# Altium project 830-00007, M2 Focus Drive.PrjPCB
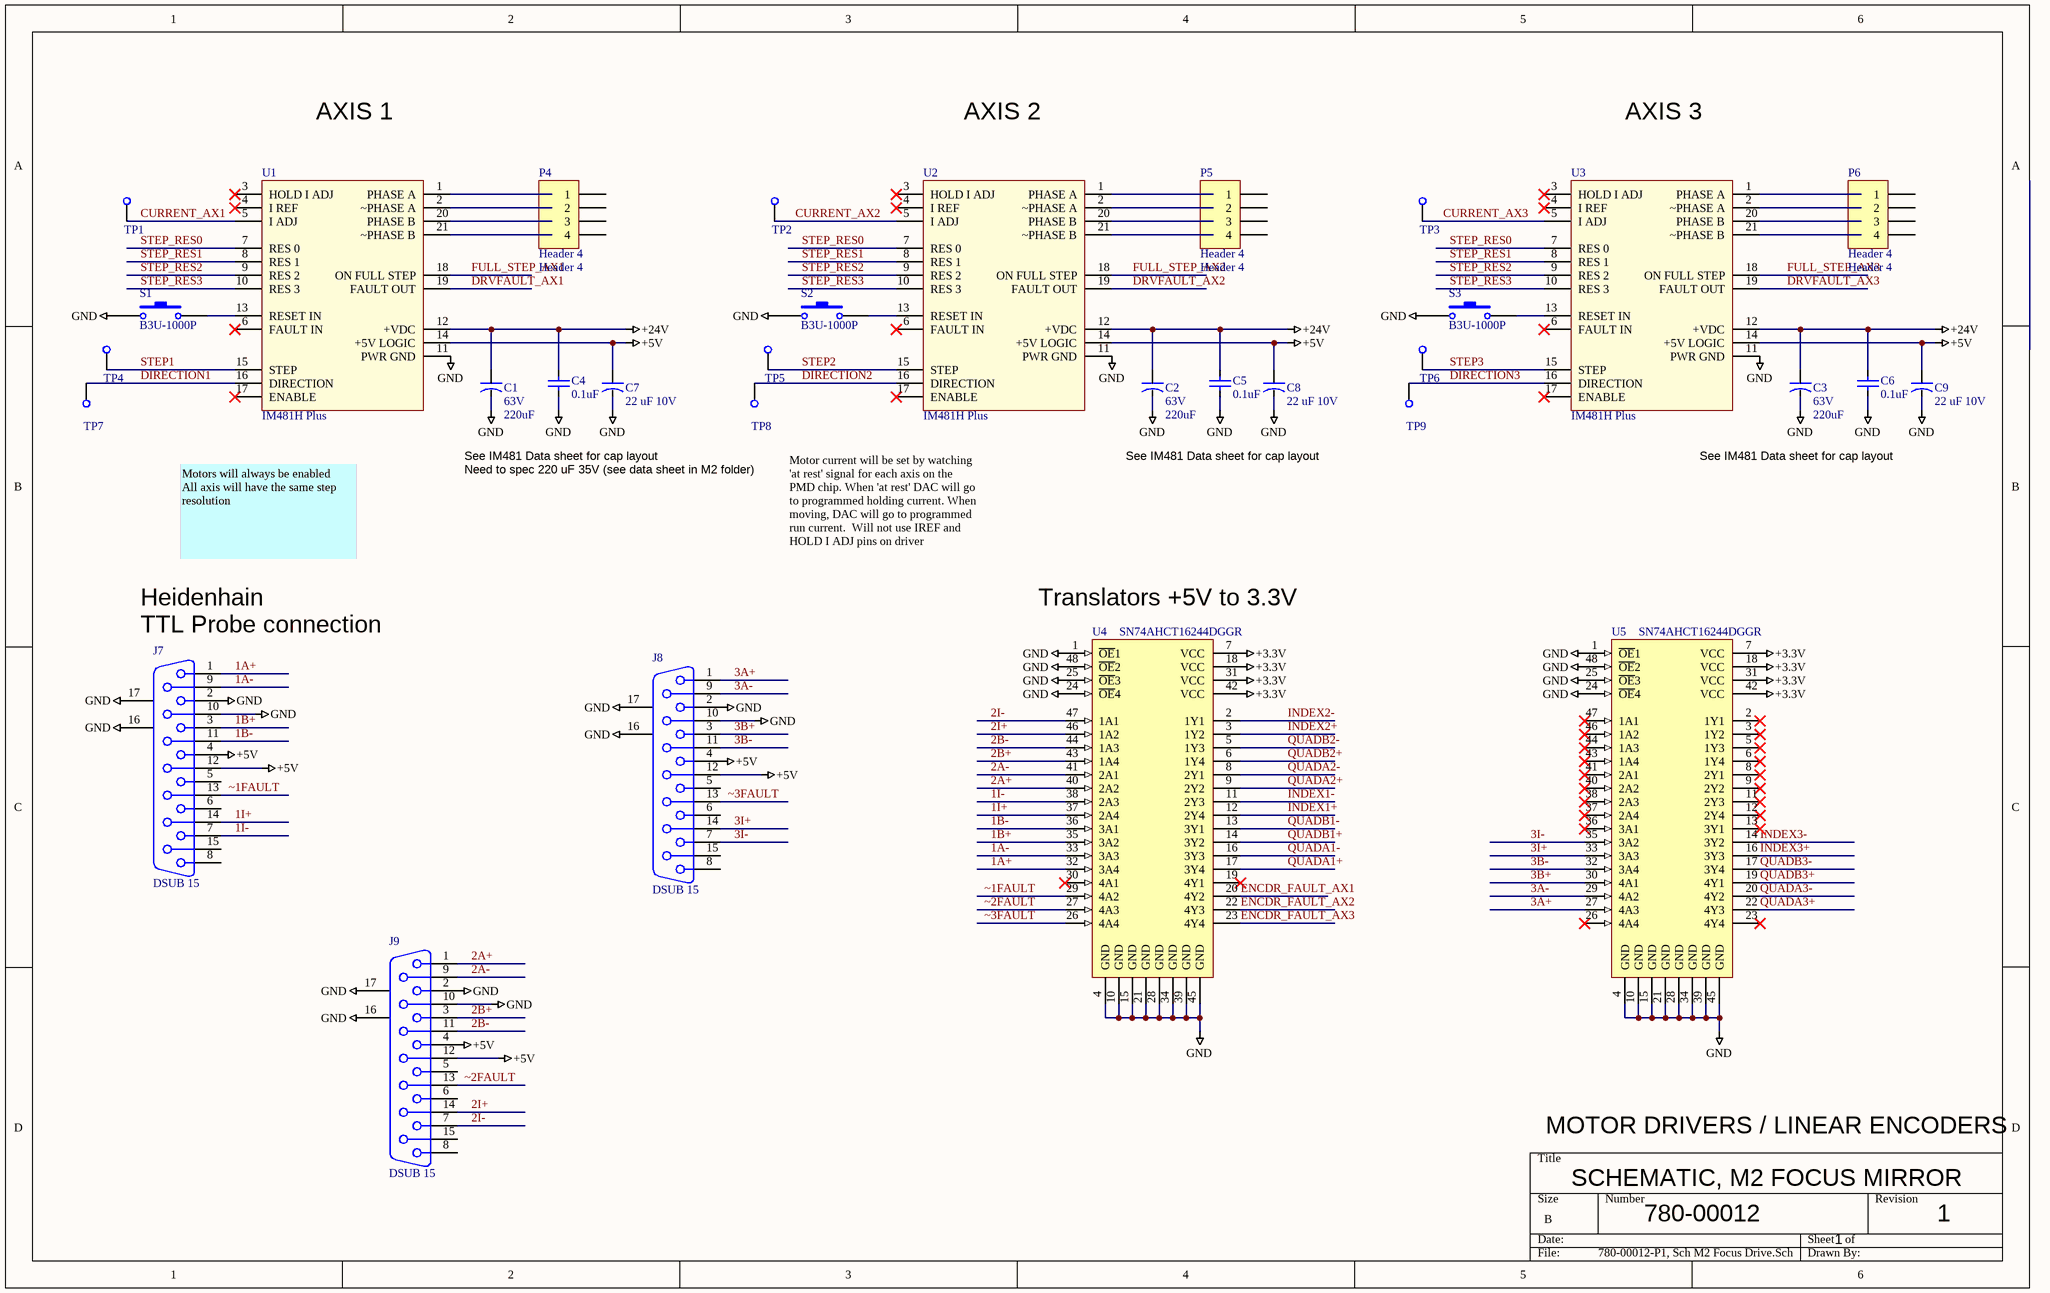
[diagram p0: 780-00012-P1, Sch M2 Focus Drive.SchDoc]
2 sheets, 92 parts. Net scope: global (net labels, ports and power ports of the same name join across sheets).
Board file: 175-00008 rev 1, PCB, M2 Focus Drive.PcbDoc
Sheets:
  780-00012-P1, Sch M2 Focus Drive.SchDoc
  780-00012-P4, Sch M2 Focus Drive.SchDoc

## Sheet 780-00012-P1, Sch M2 Focus Drive.SchDoc
size B; PageSetup: Record=PageOptions|CenterHorizontal=True|CenterVertical=True|PrintScale=1.09|XCorrection=1.00|YCorrection=1.00|PrintKind=0|BorderSize=5000000|LeftOffset=0|BottomOffset=0|Orientation=2|PaperLength=1000|PaperWidth=1000|Scale=100|PaperSource=7|PrintQuality=-4|MediaType=1|DitherType=10|PaperKind=Tabloid 11 x 17in|PrintScaleMode=1

### Parts
C1  63V  value 220uF  [CAP 220uF 63V]
C2  63V  value 220uF  [CAP 220uF 63V]
C3  63V  value 220uF  [CAP 220uF 63V]
C4  value 0.1uF  [SMD_0805]  (hidden comment: Cap SMD)
C5  value 0.1uF  [SMD_0805]  (hidden comment: Cap SMD)
C6  value 0.1uF  [SMD_0805]  (hidden comment: Cap SMD)
C7  value 22 uF 10V  [SMD_CAP_3216]  (hidden comment: 16V)
C8  value 22 uF 10V  [SMD_CAP_3216]  (hidden comment: 16V)
C9  value 22 uF 10V  [SMD_CAP_3216]  (hidden comment: 16V)
J7  DSUB 15  [DSUB15 PCB VERT Female]
J8  DSUB 15  [DSUB15 PCB VERT Female]
J9  DSUB 15  [DSUB15 PCB VERT Female]
P4  Header 4  [HDR1X4 for IDC]
P5  Header 4  [HDR1X4 for IDC]
P6  Header 4  [HDR1X4 for IDC]
S1  B3U-1000P  [B3U-1000P]
S2  B3U-1000P  [B3U-1000P]
S3  B3U-1000P  [B3U-1000P]
TP1  Test Point SMD  [SMD_TEST POINT]  (value not drawn)
TP2  Test Point SMD  [SMD_TEST POINT]  (value not drawn)
TP3  Test Point SMD  [SMD_TEST POINT]  (value not drawn)
TP4  Test Point SMD  [SMD_TEST POINT]  (value not drawn)
TP5  Test Point SMD  [SMD_TEST POINT]  (value not drawn)
TP6  Test Point SMD  [SMD_TEST POINT]  (value not drawn)
TP7  Test Point SMD  [SMD_TEST POINT]  (value not drawn)
TP8  Test Point SMD  [SMD_TEST POINT]  (value not drawn)
TP9  Test Point SMD  [SMD_TEST POINT]  (value not drawn)
U1  IM481H Plus  [IM481H Vertical]
U2  IM481H Plus  [IM481H Vertical]
U3  IM481H Plus  [IM481H Vertical]
U4  SN74AHCT16244DGGR  [DGG048_N]
U5  SN74AHCT16244DGGR  [DGG048_N]

### Nets
+3.3V: U4.7(VCC) U4.18(VCC) U4.31(VCC) U4.42(VCC) U5.7(VCC) U5.18(VCC) U5.31(VCC) U5.42(VCC)
+5V: C7.1 C8.1 C9.1 J7.4 J7.12 J8.4 J8.12 J9.4 J9.12 U1.14(+5V_LOGIC) U2.14(+5V_LOGIC) U3.14(+5V_LOGIC)
+24V: C1.1 C2.1 C3.1 C4.2 C5.2 C6.2 U1.12(+VDC) U2.12(+VDC) U3.12(+VDC)
GND: C1.2 C2.2 C3.2 C4.1 C5.1 C6.1 C7.2 C8.2 C9.2 J7.2 J7.10 J7.16(MH1) J7.17(MH2) J8.2 J8.10 J8.16(MH1) J8.17(MH2) J9.2 J9.10 J9.16(MH1) J9.17(MH2) S1.1 S2.1 S3.1 U1.11(PWR_GND) U2.11(PWR_GND) U3.11(PWR_GND) U4.1(~{OE}1) U4.4(GND) U4.10(GND) U4.15(GND) U4.21(GND) U4.24(~{OE}4) U4.25(~{OE}3) U4.28(GND) U4.34(GND) U4.39(GND) U4.45(GND) U4.48(~{OE}2) U5.1(~{OE}1) U5.4(GND) U5.10(GND) U5.15(GND) U5.21(GND) U5.24(~{OE}4) U5.25(~{OE}3) U5.28(GND) U5.34(GND) U5.39(GND) U5.45(GND) U5.48(~{OE}2)
1A+: J7.1 U4.32(3A4)
1A-: J7.9 U4.33(3A3)
1B+: J7.3 U4.35(3A2)
1B-: J7.11 U4.36(3A1)
1I+: J7.14 U4.37(2A4)
1I-: J7.7 U4.38(2A3)
2A+: J9.1 U4.40(2A2)
2A-: J9.9 U4.41(2A1)
2B+: J9.3 U4.43(1A4)
2B-: J9.11 U4.44(1A3)
2I+: J9.14 U4.46(1A2)
2I-: J9.7 U4.47(1A1)
3A+: J8.1 U5.27(4A3)
3A-: J8.9 U5.29(4A2)
3B+: J8.3 U5.30(4A1)
3B-: J8.11 U5.32(3A4)
3I+: J8.14 U5.33(3A3)
3I-: J8.7 U5.35(3A2)
CURRENT_AX1: TP1.1(TP) U1.5(I_ADJ)
CURRENT_AX2: TP2.1(TP) U2.5(I_ADJ)
CURRENT_AX3: TP3.1(TP) U3.5(I_ADJ)
DIRECTION1: TP7.1(TP) U1.16(DIRECTION)
DIRECTION2: TP8.1(TP) U2.16(DIRECTION)
DIRECTION3: TP9.1(TP) U3.16(DIRECTION)
DRVFAULT_AX1: U1.19(FAULT_OUT)
DRVFAULT_AX2: U2.19(FAULT_OUT)
DRVFAULT_AX3: U3.19(FAULT_OUT)
ENCDR_FAULT_AX1: U4.20(4Y2)
ENCDR_FAULT_AX2: U4.22(4Y3)
ENCDR_FAULT_AX3: U4.23(4Y4)
FULL_STEP_AX1: U1.18(ON_FULL_STEP)
FULL_STEP_AX2: U2.18(ON_FULL_STEP)
FULL_STEP_AX3: U3.18(ON_FULL_STEP)
INDEX1+: U4.12(2Y4)
INDEX1-: U4.11(2Y3)
INDEX2+: U4.3(1Y2)
INDEX2-: U4.2(1Y1)
INDEX3+: U5.16(3Y3)
INDEX3-: U5.14(3Y2)
QUADA1+: U4.17(3Y4)
QUADA1-: U4.16(3Y3)
QUADA2+: U4.9(2Y2)
QUADA2-: U4.8(2Y1)
QUADA3+: U5.22(4Y3)
QUADA3-: U5.20(4Y2)
QUADB1+: U4.14(3Y2)
QUADB1-: U4.13(3Y1)
QUADB2+: U4.6(1Y4)
QUADB2-: U4.5(1Y3)
QUADB3+: U5.19(4Y1)
QUADB3-: U5.17(3Y4)
STEP1: TP4.1(TP) U1.15(STEP)
STEP2: TP5.1(TP) U2.15(STEP)
STEP3: TP6.1(TP) U3.15(STEP)
STEP_RES0: U1.7(RES_0) U2.7(RES_0) U3.7(RES_0)
STEP_RES1: U1.8(RES_1) U2.8(RES_1) U3.8(RES_1)
STEP_RES2: U1.9(RES_2) U2.9(RES_2) U3.9(RES_2)
STEP_RES3: U1.10(RES_3) U2.10(RES_3) U3.10(RES_3)
~1FAULT: J7.13 U4.29(4A2)
~2FAULT: J9.13 U4.27(4A3)
~3FAULT: J8.13 U4.26(4A4)
NetS1_2: S1.2 U1.13(RESET_IN)
NetS2_2: S2.2 U2.13(RESET_IN)
NetS3_2: S3.2 U3.13(RESET_IN)

Not connected (* = marked no-connect by the designer): J7 5 6 8 15; J8 5 6 8 15; J9 5 6 8 15; P4 1 2 3 4; P5 1 2 3 4; P6 1 2 3 4; U1 1(PHASE_A) 2(~PHASE_A) 3(HOLD_I_ADJ)* 4(I_REF)* 6(FAULT_IN)* 17(ENABLE)* 20(PHASE_B) 21(~PHASE_B); U2 1(PHASE_A) 2(~PHASE_A) 3(HOLD_I_ADJ)* 4(I_REF)* 6(FAULT_IN)* 17(ENABLE)* 20(PHASE_B) 21(~PHASE_B); U3 1(PHASE_A) 2(~PHASE_A) 3(HOLD_I_ADJ)* 4(I_REF)* 6(FAULT_IN)* 17(ENABLE)* 20(PHASE_B) 21(~PHASE_B); U4 19(4Y1)* 30(4A1)*; U5 2(1Y1)* 3(1Y2)* 5(1Y3)* 6(1Y4)* 8(2Y1)* 9(2Y2)* 11(2Y3)* 12(2Y4)* 13(3Y1)* 23(4Y4)* 26(4A4)* 36(3A1)* 37(2A4)* 38(2A3)* 40(2A2)* 41(2A1)* 43(1A4)* 44(1A3)* 46(1A2)* 47(1A1)*

### Notes on the sheet
- AXIS 1
- AXIS 2
- AXIS 3
- See IM481 Data sheet for cap layout
- Need to spec 220 uF 35V (see data sheet in M2 folder)
- Motors will always be enabled
  All axis will have the same step resolution
- Motor current will be set by watching 'at rest' signal for each axis on the PMD chip. When 'at rest' DAC will go to programmed holding current. When moving, DAC will go to programmed run current.  Will not use IREF and HOLD I ADJ pins on driver
- (near J7) TTL Probe connection
- Heidenhain
- (near U4) Translators +5V to 3.3V
- MOTOR DRIVERS / LINEAR ENCODERS
- SCHEMATIC, M2 FOCUS MIRROR
- 780-00012
- 1

### Library data of the parts
C1-C3 = Cap 220uF, 63V: CAP 220UF 63V ELECT MVH SMD; Manufacturer: United Chemi-Con; Manuf p/n: EMVH630ARA221MKG5S; Vendor: DigiKey; Vendor p/n: 565-2337-1-ND; Vendor Mult.: 5; LCO p/n: 120-00041; To Do list: New LCO pn; COST: 2.10
C4-C6 = Cap SMD: Capacitor; LCO p/n: 120-00002
C7-C9 = Cap Tant 16V: outline 3.2mm x 1.6mm; Manufacturer: KEMET; Manuf p/n: T494A106M016AT; Vendor: DIGIKEY; Vendor p/n: 399-3824-1-ND; Vendor Mult.: 1; LCO p/n: 120-00001; COST: 0.78
J7-J9 = DSUB 15: Receptacle Assembly, 15 Position; LCO p/n: 125-00038
P4-P6 = Header 4: Header, 4-Pin; LCO p/n: 125-00037; VALUE: Header 4
S1-S3 = SW-PB: Switch; Manufacturer: Omron Electronics; Vendor: DIGIKEY; Vendor Mult.: 1; Vendor p/n: SW1020CT-ND; Value: SW PB; LCO p/n: 185-00005; COST: 0.96; Manuf p/n: B3U-1000P
TP1-TP9 = Test Point SMD: SMD loop test point; LCO p/n: 160-00001; VALUE: Test Point SMD
U1-U3 = IM481H Plus: Hybrid stepper motor driver; LCO p/n: 170-00001; VALUE: IM481H
U4 U5 = SN74AHCT16244DGGR: 16-Bit Buffer/Driver with 3-State Outputs; LCO p/n: 150-00065

## Sheet 780-00012-P4, Sch M2 Focus Drive.SchDoc
size B; PageSetup: Record=PageOptions|CenterHorizontal=True|CenterVertical=True|PrintScale=1.09|XCorrection=1.00|YCorrection=1.00|PrintKind=0|BorderSize=5000000|LeftOffset=0|BottomOffset=0|Orientation=2|PaperLength=1000|PaperWidth=1000|Scale=100|PaperSource=7|PrintQuality=-4|MediaType=1|DitherType=10|PaperKind=Tabloid 11 x 17in|PrintScaleMode=1
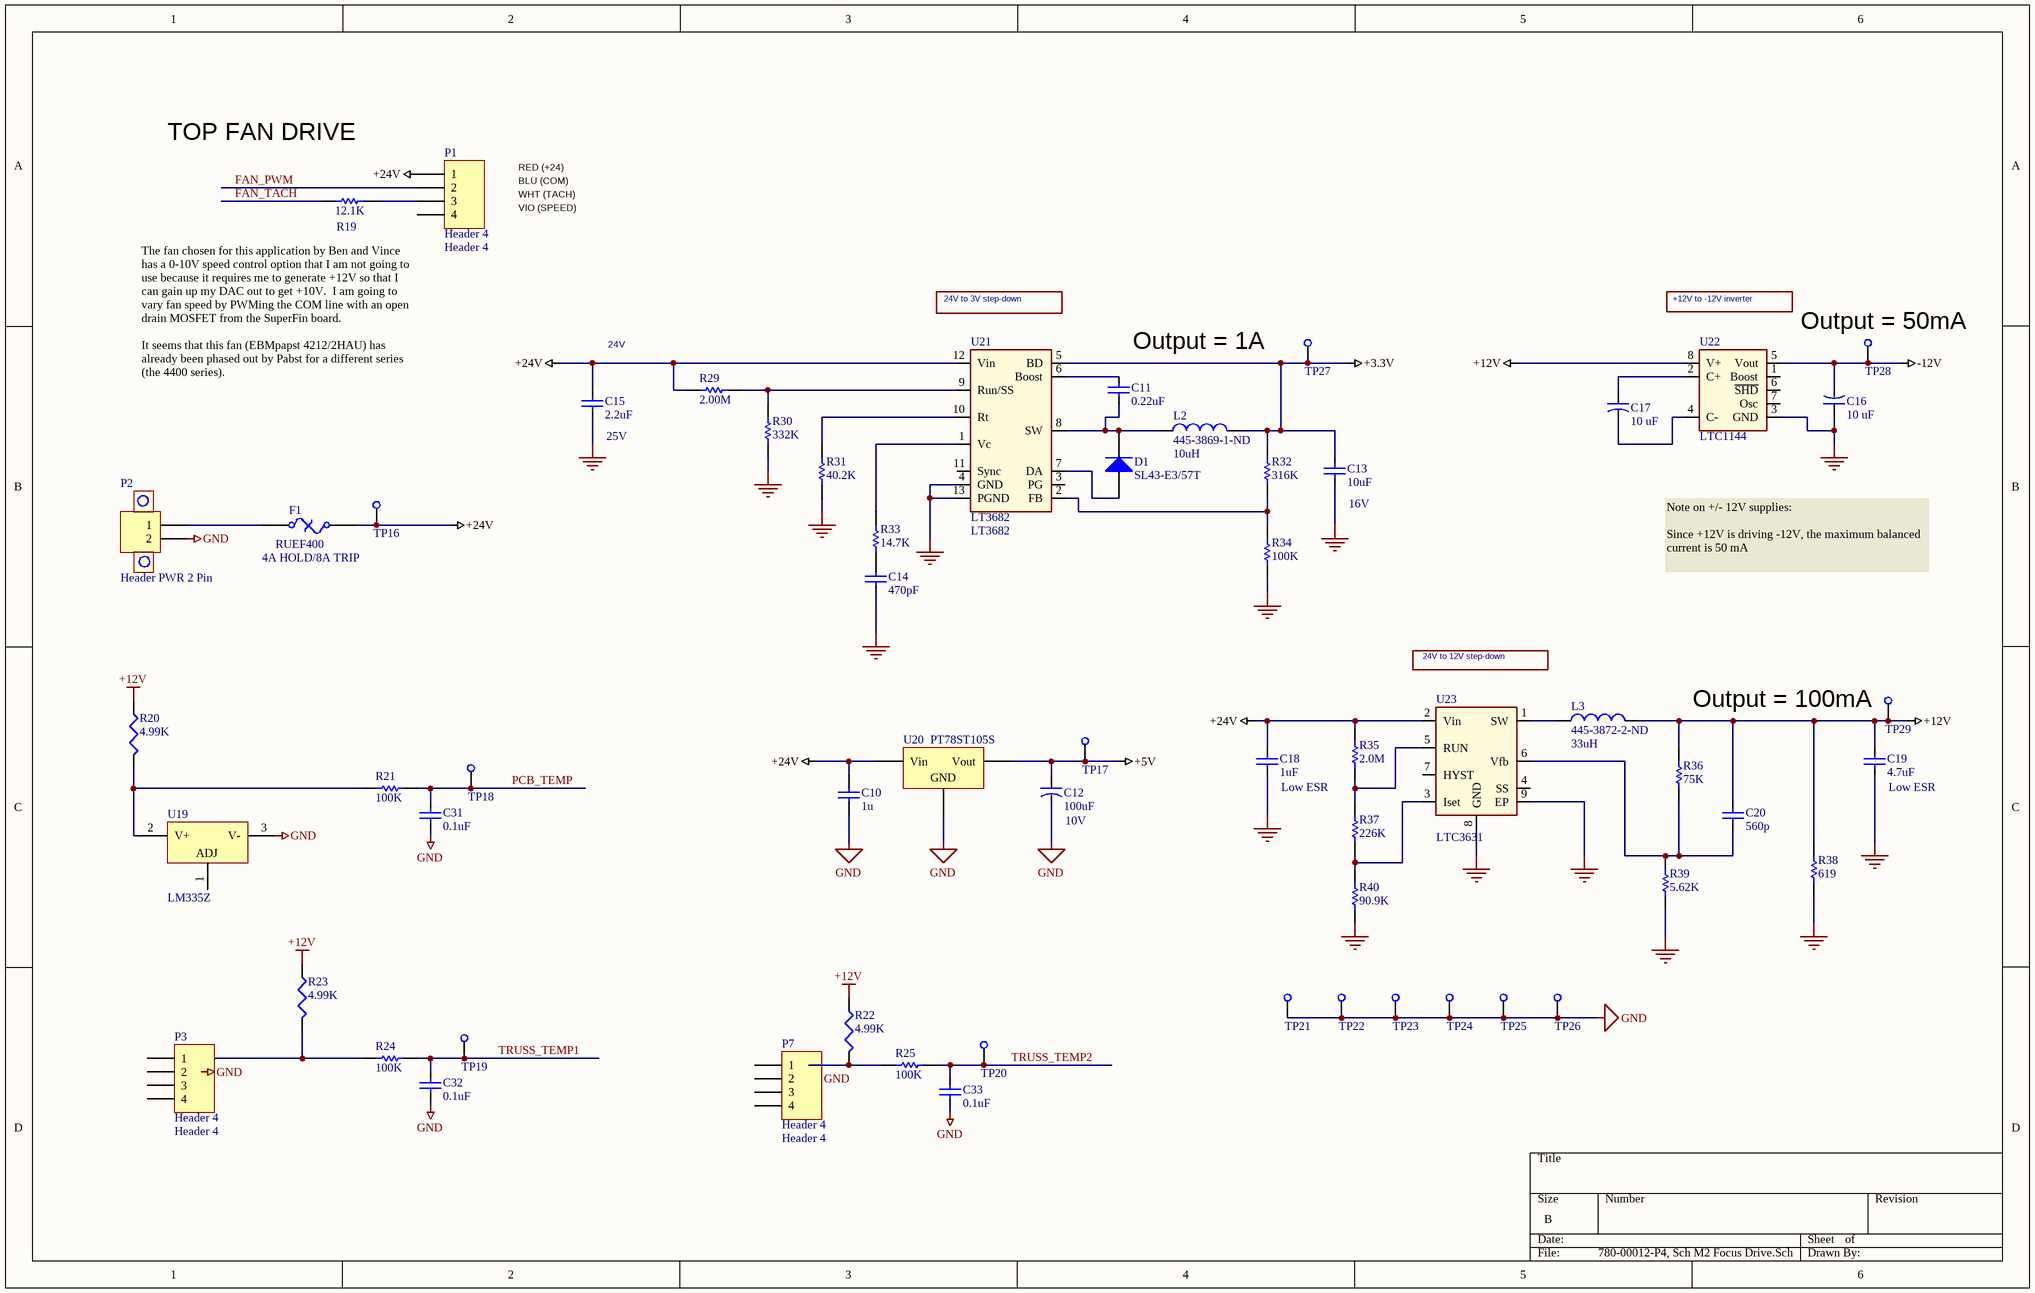
[diagram p1: 780-00012-P4, Sch M2 Focus Drive.SchDoc]

### Parts
C10  1u  [2012[0805]]
C11  value 0.22uF  [SMD_0805]  (hidden comment: Cap SMD)
C12  10V  value 100uF  [SMD_CAP_7343]
C13  16V  value 10uF  [SMD_0805]
C14  value 470pF  [SMD_0805]  (hidden comment: Cap SMD)
C15  25V  value 2.2uF  [SMD_0805]
C16  value 10 uF  [SMD_CAP_3216]  (hidden comment: 16V)
C17  value 10 uF  [SMD_CAP_3216]  (hidden comment: 16V)
C18  Low ESR  value 1uF  [SMD_1206]
C19  Low ESR  value 4.7uF  [SMD_1206]
C20  value 560p  [SMD_0805]  (hidden comment: Cap SMD)
C31  value 0.1uF  [SMD_0805]  (hidden comment: Cap SMD)
C32  value 0.1uF  [SMD_0805]  (hidden comment: Cap SMD)
C33  value 0.1uF  [SMD_0805]  (hidden comment: Cap SMD)
D1  SL43-E3/57T  [SMC]
F1  RUEF400  value 4A HOLD/8A TRIP  [PolySwitch Radial 0.2]
L2  445-3869-1-ND  value 10uH  [Inductor TDC SLF]
L3  445-3872-2-ND  value 33uH  [Inductor TDC SLF]
P1  Header 4  [HDR1X4 for IDC]
P2  Header PWR 2 Pin  [HDR-2 pin w/screw]
P3  Header 4  [HDR1X4 for IDC]
P7  Header 4  [HDR1X4 for IDC]
R19  value 12.1K  [SMD_0805]  (hidden comment: Res 0805)
R20  value 4.99K  [smd_0805]  (hidden comment: Res3)
R21  value 100K  [SMD_0805]  (hidden comment: Res SMD)
R22  value 4.99K  [smd_0805]  (hidden comment: Res3)
R23  value 4.99K  [smd_0805]  (hidden comment: Res3)
R24  value 100K  [SMD_0805]  (hidden comment: Res SMD)
R25  value 100K  [SMD_0805]  (hidden comment: Res SMD)
R29  value 2.00M  [SMD_0805]  (hidden comment: Res 0805)
R30  value 332K  [SMD_0805]  (hidden comment: Res 0805)
R31  value 40.2K  [SMD_0805]  (hidden comment: Res 0805)
R32  value 316K  [SMD_0805]  (hidden comment: Res 0805)
R33  value 14.7K  [SMD_0805]  (hidden comment: Res 0805)
R34  value 100K  [SMD_0805]  (hidden comment: Res 0805)
R35  value 2.0M  [SMD_0805]  (hidden comment: Res 0805)
R36  value 75K  [SMD_0805]  (hidden comment: Res 0805)
R37  value 226K  [SMD_0805]  (hidden comment: Res 0805)
R38  value 619  [SMD_0805]  (hidden comment: Res 0805)
R39  value 5.62K  [SMD_0805]  (hidden comment: Res 0805)
R40  value 90.9K  [SMD_0805]  (hidden comment: Res 0805)
TP16  Test Point SMD  [SMD_TEST POINT]  (value not drawn)
TP17  Test Point SMD  [SMD_TEST POINT]  (value not drawn)
TP18  Test Point SMD  [SMD_TEST POINT]  (value not drawn)
TP19  Test Point SMD  [SMD_TEST POINT]  (value not drawn)
TP20  Test Point SMD  [SMD_TEST POINT]  (value not drawn)
TP21  Test Point SMD  [SMD_TEST POINT]  (value not drawn)
TP22  Test Point SMD  [SMD_TEST POINT]  (value not drawn)
TP23  Test Point SMD  [SMD_TEST POINT]  (value not drawn)
TP24  Test Point SMD  [SMD_TEST POINT]  (value not drawn)
TP25  Test Point SMD  [SMD_TEST POINT]  (value not drawn)
TP26  Test Point SMD  [SMD_TEST POINT]  (value not drawn)
TP27  Test Point SMD  [SMD_TEST POINT]  (value not drawn)
TP28  Test Point SMD  [SMD_TEST POINT]  (value not drawn)
TP29  Test Point SMD  [SMD_TEST POINT]  (value not drawn)
U19  LM335Z  [Z03A]
U20  PT78ST105S  [PSIP_3_SMD]
U21  LT3682  [DD12/DFN12]
U22  LTC1144  [S8_M]
U23  LTC3631  [DD8/DFN8]

### Nets
+3.3V: C13.2 L2.2 R32.2 TP27.1(TP) U21.5(BD)
+5V: C12.pos TP17.1(TP) U20.3(Vout)
+12V: C19.2 C20.2 L3.2 R20.1 R22.1 R23.1 R36.2 R38.2 TP29.1(TP) U22.8(V+)
+24V: C10.1 C15.2 C18.2 F1.2 P1.1 R29.1 R35.2 TP16.1(TP) U20.1(Vin) U21.12(Vin) U23.2(Vin)
-12V: C16.2 TP28.1(TP) U22.5(Vout)
GND: C10.2 C12.neg C13.1 C14.1 C15.1 C16.1 C18.1 C19.1 C31.1 C32.1 C33.1 P2.2 R30.1 R31.1 R34.1 R38.1 R39.1 R40.1 TP21.1(TP) TP22.1(TP) TP23.1(TP) TP24.1(TP) TP25.1(TP) TP26.1(TP) U19.3(V-) U20.2(GND) U21.4(GND) U21.13(PGND) U22.3(GND) U23.8(GND) U23.9(EP)
SUPPORT: U20.0(SUPPORT)
FAN_PWM: P1.2
FAN_TACH: R19.1
PCB_TEMP: C31.2 R21.1 TP18.1(TP)
TRUSS_TEMP1: C32.2 R24.1 TP19.1(TP)
TRUSS_TEMP2: C33.2 R25.1 TP20.1(TP)
NetC11_1: C11.1 D1.2(K) L2.1 U21.8(SW)
NetC11_2: C11.2 U21.6(Boost)
NetC14_2: C14.2 R33.1
NetC17_1: C17.1 U22.2(C+)
NetC17_2: C17.2 U22.4(C-)
NetC20_1: C20.1 R36.1 R39.2 U23.6(Vfb)
NetD1_1: D1.1(A) U21.7(DA)
NetF1_1: F1.1 P2.1
NetL3_1: L3.1 U23.1(SW)
NetP1_3: P1.3 R19.2
NetR20_2: R20.2 R21.2 U19.2(V+)
NetR22_2: R22.2 R25.2
NetR23_2: R23.2 R24.2
NetR29_2: R29.2 R30.2 U21.9(Run/SS)
NetR31_2: R31.2 U21.10(Rt)
NetR32_1: R32.1 R34.2 U21.2(FB)
NetR33_2: R33.2 U21.1(Vc)
NetR35_1: R35.1 R37.2 U23.5(RUN)
NetR37_1: R37.1 R40.2 U23.3(Iset)

Not connected (* = marked no-connect by the designer): P1 4; P3 1 2 3 4; P7 1 2 3 4; U19 1(ADJ); U21 3(PG) 11(Sync); U22 1(Boost) 6(~{SHD}) 7(Osc); U23 4(SS) 7(HYST)

### Notes on the sheet
- TOP FAN DRIVE
- RED (+24)
- BLU (COM)
- WHT (TACH)
- VIO (SPEED)
- 24V to 3V step-down
- +12V to -12V inverter
- (near C15) 24V
- Output = 1A
- (near TP28) Output = 50mA
- The fan chosen for this application by Ben and Vince has a 0-10V speed control option that I am not going to use because it requires me to generate +12V so that I can gain up my DAC out to get +10V.  I am going to vary fan speed by PWMing the COM line with an open drain MOSFET from the SuperFin board.
  It seems that this fan (EBMpapst 4212/2HAU) has already been phased out by Pabst for a different series (the 4400 series).
- Note on +/- 12V supplies:
  Since +12V is driving -12V, the maximum balanced current is 50 mA
- 24V to 12V step-down
- Output = 100mA
- Labels drawn without touching a wire or pin: GND

### Library data of the parts
C10 = Cap: Capacitor; Manufacturer: Taiyo Yuden; Manuf p/n: UMK212F105ZG-T; Vendor: DIGIKEY; Vendor Mult.: 10; Vendor p/n: 587-1308-1-ND; LCO p/n: 120-00027; Value: 1u; COST: 0.088
C11 = Cap SMD: Capacitor; LCO p/n: 120-00042
C12 = Cap Tant 35V: outline 6.0mm x 3.2mm; Manufacturer: kEMET; Manuf p/n: T520V107M010ATE045; Vendor: DigiKey; Vendor p/n: 399-4070-1-ND; Vendor Mult.: 1; LCO p/n: 120-00025; COST: 3.49
C13 = Cap SMD: Capacitor; LCO p/n: 120-00007
C14 = Cap SMD: Capacitor; LCO p/n: 120-00037
C15 = Cap SMD: Capacitor; Manufacturer: Taiyo Yuden; Manuf p/n: TMK212BJ225KG-T; Vendor: Digi-Key; Vendor p/n: 587-1292-1-ND; Vendor Mult.: 10; LCO p/n: 120-00038; COST: 0.275
C16 C17 = Cap Tant 16V: as C7 on sheet 780-00012-P1, Sch M2 Focus Drive; COST: 0.78
C18 = Cap SMD: Capacitor; Manufacturer: TDK; Manuf p/n: C3225X7R1H105K/1.6; Vendor: Digi-Key; Vendor p/n: 445-3931-1-ND; Vendor Mult.: 10; LCO p/n: 120-00039
C19 = Cap SMD: Capacitor; Manufacturer: TDK; Manuf p/n: C3216X7R1E475K; Vendor: Digi-Key; Vendor p/n: 445-1606-1-ND; Vendor Mult.: 10; LCO p/n: 120-00040
C20 = Cap SMD: Capacitor; LCO p/n: 120-00036
C31-C33 = Cap SMD: Capacitor; Manufacturer: AVX; Manuf p/n: 08055C104KAT2A; Vendor: DigiKey; Vendor p/n: 478-1395-1-ND; Vendor Mult.: 10; LCO p/n: 120-00002; COST: 0.09; Arena Type: Capacitor
D1 = Diode: Default Diode; Manufacturer: Vishay/Dale; Value: 4A 30V; Vendor: DigiKey; Vendor Mult.: 1; Vendor p/n: SL43-E3/57TGICT-ND; LCO p/n: 140-00002; COST: 0.98; Manuf p/n: SL43-E3/57T; Arena Type: Diode
F1 = Fuse Thermal: PolySwitch RUE Series; Manufacturer: Tyco Electronics; Vendor: DIGIKEY; Vendor Mult.: 1; Vendor p/n: RUEF400-ND; LCO p/n: 145-00003; COST: 0.50; Manuf p/n: RUEF400
L2 = Inductor SMD 10uH 1.8A: Inductor; Manufacturer: TDK; Manuf p/n: SLF7045T-100M1R8-H; Vendor: Digi-Key; Vendor Mult.: 1; LCO p/n: 155-00015; Vendor p/n: 445-3869-1-ND
L3 = Inductor SMD 10uH 1.8A: Inductor; Manufacturer: TDK; Manuf p/n: SLF7045T-330M1R1-H; Vendor: Digi-Key; Vendor Mult.: 1; LCO p/n: 155-00016; Vendor p/n: 445-3872-2-ND
P1 P3 P7 = Header 4: Header, 4-Pin; LCO p/n: 125-00037; VALUE: Header 4
P2 = Header 2 PWR: Header, 2-Pin; LCO p/n: 125-00041; VALUE: Header 2-pin PWR
R19 = Res SMD: Resistor 0805; Manufacturer: Vishay/Dale; Manuf p/n: CRCW080512.1KFKEA; Vendor: DIGIKEY; Vendor p/n: 541-12.1KCCT-ND; Vendor Mult.: 10; LCO p/n: 181-01211; COST: 0.09
R20 R22 R23 = Res3: Resistor; Manufacturer: DALE; Manuf p/n: CRCW08054.99KFKEA; Vendor: DigiKey; Vendor Mult.: 10; Vendor p/n: 541-4.99KCCT-ND; LCO p/n: 181-04991; COST: 0.09; Arena Type: Resistor
R21 R24 R25 = Res SMD: Resistor; Manufacturer: Vishay/Dale; Manuf p/n: CRCW0805100KFKEA; Vendor: DigiKey; Vendor p/n: 541-100KCCT-ND; Vendor Mult.: 10; LCO p/n: 181-01003; COST: 0.09; Arena Type: Resistor
R29 = Res SMD: Resistor 0805; Manufacturer: Vishay/Dale; Manuf p/n: CRCW08052.00MFKEA; Vendor: DIGIKEY; Vendor p/n: 541-2.00MCCT-ND; Vendor Mult.: 10; LCO p/n: 181-02004; COST: 0.09
R30 = Res SMD: Resistor 0805; Manufacturer: Vishay/Dale; Manuf p/n: CRCW0805332KFKEA; Vendor: DIGIKEY; Vendor p/n: 541-332KCCT-ND; Vendor Mult.: 10; LCO p/n: 181-03323; COST: 0.09
R31 = Res SMD: Resistor 0805; Manufacturer: Vishay/Dale; Manuf p/n: CRCW080540.2KFKEA; Vendor: DIGIKEY; Vendor p/n: 541-40.2KCCT-ND; Vendor Mult.: 10; LCO p/n: 181-04021; COST: 0.09
R32 = Res SMD: Resistor 0805; Manufacturer: Vishay/Dale; Manuf p/n: CRCW0805316KFKEA; Vendor: DIGIKEY; Vendor p/n: 541-316KCCT-ND; Vendor Mult.: 10; LCO p/n: 181-03163; COST: 0.09
R33 = Res SMD: Resistor 0805; Manufacturer: Vishay/Dale; Manuf p/n: CRCW080514.7KFKEA; Vendor: DIGIKEY; Vendor p/n: 541-14.7KCCT-ND; Vendor Mult.: 10; LCO p/n: 181-01472; COST: 0.09
R34 = Res SMD: Resistor 0805; Manufacturer: Vishay/Dale; Manuf p/n: CRCW0805100KFKEA; Vendor: DIGIKEY; Vendor p/n: 541-100KCCT-ND; Vendor Mult.: 10; LCO p/n: 181-01003; COST: 0.09
R35 = Res SMD: Resistor 0805; Manufacturer: Vishay/Dale; Manuf p/n: CRCW08052.0MFKEA; Vendor: DIGIKEY; Vendor p/n: 541-2.0MCCT-ND; Vendor Mult.: 10; LCO p/n: 181-02004; COST: 0.09
R36 = Res SMD: Resistor 0805; Manufacturer: Vishay/Dale; Manuf p/n: CRCW080575KFKEA; Vendor: DIGIKEY; Vendor p/n: 541-75KCCT-ND; Vendor Mult.: 10; LCO p/n: 181-07502; COST: 0.09
R37 = Res SMD: Resistor 0805; Manufacturer: Vishay/Dale; Manuf p/n: CRCW0805226KFKEA; Vendor: DIGIKEY; Vendor p/n: 541-226KCCT-ND; Vendor Mult.: 10; LCO p/n: 181-02263; COST: 0.09
R38 = Res SMD: Resistor 0805; Manufacturer: Vishay/Dale; Manuf p/n: CRCW0805619FKEA; Vendor: DIGIKEY; Vendor p/n: 541-619CCT-ND; Vendor Mult.: 10; LCO p/n: 181-06190; COST: 0.09
R39 = Res SMD: Resistor 0805; Manufacturer: Vishay/Dale; Manuf p/n: CRCW08055.62KFKEA; Vendor: DIGIKEY; Vendor p/n: 541-5.62KCCT-ND; Vendor Mult.: 10; LCO p/n: 181-05621; COST: 0.09
R40 = Res SMD: Resistor 0805; Manufacturer: Vishay/Dale; Manuf p/n: CRCW080590.9KFKEA; Vendor: DIGIKEY; Vendor p/n: 541-90.9KCCT-ND; Vendor Mult.: 10; LCO p/n: 181-09092; COST: 0.09
TP16-TP29 = Test Point SMD: SMD loop test point; LCO p/n: 160-00001; VALUE: Test Point SMD
U19 = LM335Z: Precision Temperature Sensor; Manufacturer: National Semiconductor; LCO p/n: 150-00068
U20 = Volt Reg: Voltage Regulator; Manufacturer: Texas Instruments; Vendor: DIGIKEY; Vendor Mult.: 1; Vendor p/n: PT78ST105S-ND; LCO p/n: 150-00013; COST: 14.41; Manuf p/n: PT78ST105S; Value: PT78ST105S
U21 = LT3682: 1A uPwr Step-Down switching regulator; Manufacturer: Linear; Manuf p/n: LT3682EDD#PBF; LCO p/n: 150-00069; Vendor: Digi-Key; Vendor Mult.: 1; Vendor p/n: LT3682EDD#PBF-ND; COST: 6.28; VALUE: LT3682
U22 = LTC1144: IC VOLT CONV SW-CAP W/SHTDN8SOIC; Manufacturer: Linear; Manuf p/n: LTC1144CS8#PBF; LCO p/n: 150-00070; Vendor: Digi_Key; Vendor Mult.: 1; Vendor p/n: LTC1144CS8#PBF-ND; COST: 4.90; VALUE: LTC1144
U23 = LTC3631: IC CONV STP-DWN ADJ 8-DFN; Manufacturer: Linear; Manuf p/n: LTC3631EDD#PBF; LCO p/n: 150-00071; Vendor: Digi-Key; Vendor Mult.: 1; Vendor p/n: LTC3631EDD#PBF-ND; COST: 6.28; VALUE: LTC3631

## Nets that join several sheets
+3.3V: 780-00012-P1, Sch M2 Focus Drive (8 pins), 780-00012-P4, Sch M2 Focus Drive (5 pins)
+5V: 780-00012-P1, Sch M2 Focus Drive (12 pins), 780-00012-P4, Sch M2 Focus Drive (C12.pos TP17.1 U20.3)
+24V: 780-00012-P1, Sch M2 Focus Drive (9 pins), 780-00012-P4, Sch M2 Focus Drive (11 pins)
GND: 780-00012-P1, Sch M2 Focus Drive (51 pins), 780-00012-P4, Sch M2 Focus Drive (31 pins)